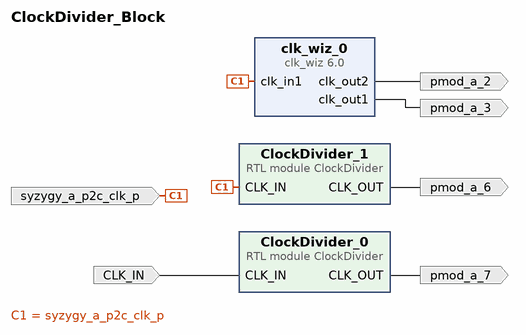
[diagram p0: block diagram of the top level]
# Vivado block design ClockDivider_Block, xc7z020clg484-1, Vivado 2024.2.1
create_bd_design ClockDivider_Block

create_bd_port -dir I CLK_IN
create_bd_port -dir O pmod_a_7
create_bd_port -dir O pmod_a_6
create_bd_port -dir I syzygy_a_p2c_clk_p
create_bd_port -dir O pmod_a_2
create_bd_port -dir O pmod_a_3

create_bd_cell -type module -reference ClockDivider ClockDivider_0
set_property -dict {CONFIG.DIVISOR 0x000000C} [get_bd_cells ClockDivider_0]
create_bd_cell -type ip -vlnv xilinx.com:ip:clk_wiz:6.0 clk_wiz_0
set_property -dict [list \
  CONFIG.CLKIN1_JITTER_PS 600 \
  CONFIG.CLKIN1_UI_JITTER 600 \
  CONFIG.CLKIN2_JITTER_PS 100.000 \
  CONFIG.CLKIN2_UI_JITTER 100.000 \
  CONFIG.CLKOUT1_DRIVES BUFG \
  CONFIG.CLKOUT1_JITTER 155.300 \
  CONFIG.CLKOUT1_PHASE_ERROR 84.619 \
  CONFIG.CLKOUT1_REQUESTED_OUT_FREQ 122.88 \
  CONFIG.CLKOUT2_DRIVES BUFG \
  CONFIG.CLKOUT2_JITTER 412.239 \
  CONFIG.CLKOUT2_PHASE_ERROR 84.619 \
  CONFIG.CLKOUT2_REQUESTED_OUT_FREQ 10 \
  CONFIG.CLKOUT2_USED true \
  CONFIG.CLKOUT3_DRIVES BUFG \
  CONFIG.CLKOUT3_JITTER 118.048 \
  CONFIG.CLKOUT3_PHASE_ERROR 91.229 \
  CONFIG.CLKOUT3_USED false \
  CONFIG.CLKOUT4_DRIVES BUFG \
  CONFIG.CLKOUT5_DRIVES BUFG \
  CONFIG.CLKOUT6_DRIVES BUFG \
  CONFIG.CLKOUT7_DRIVES BUFG \
  CONFIG.JITTER_OPTIONS PS \
  CONFIG.JITTER_SEL Min_O_Jitter \
  CONFIG.MMCM_BANDWIDTH HIGH \
  CONFIG.MMCM_CLKFBOUT_MULT_F 10 \
  CONFIG.MMCM_CLKIN1_PERIOD 8.138 \
  CONFIG.MMCM_CLKIN2_PERIOD 10.000 \
  CONFIG.MMCM_CLKOUT0_DIVIDE_F 10 \
  CONFIG.MMCM_CLKOUT1_DIVIDE 123 \
  CONFIG.MMCM_CLKOUT2_DIVIDE 1 \
  CONFIG.MMCM_COMPENSATION ZHOLD \
  CONFIG.MMCM_DIVCLK_DIVIDE 1 \
  CONFIG.MMCM_REF_JITTER1 0.074 \
  CONFIG.MMCM_REF_JITTER2 0.010 \
  CONFIG.NUM_OUT_CLKS 2 \
  CONFIG.PRIMITIVE PLL \
  CONFIG.PRIM_IN_FREQ 122.88 \
  CONFIG.USE_RESET false \
] [get_bd_cells clk_wiz_0]
create_bd_cell -type module -reference ClockDivider ClockDivider_1
set_property -dict {CONFIG.DIVISOR 0x000000C} [get_bd_cells ClockDivider_1]

# ---- connections ----

connect_bd_net [get_bd_ports CLK_IN] [get_bd_pins ClockDivider_0/CLK_IN]
connect_bd_net [get_bd_pins ClockDivider_0/CLK_OUT] [get_bd_ports pmod_a_7]
connect_bd_net [get_bd_pins ClockDivider_1/CLK_OUT] [get_bd_ports pmod_a_6]
connect_bd_net [get_bd_pins clk_wiz_0/clk_out1] [get_bd_ports pmod_a_3]
connect_bd_net [get_bd_pins clk_wiz_0/clk_out2] [get_bd_ports pmod_a_2]
connect_bd_net [get_bd_ports syzygy_a_p2c_clk_p] [get_bd_pins clk_wiz_0/clk_in1] [get_bd_pins ClockDivider_1/CLK_IN]

validate_bd_design
save_bd_design
